# Altium schematic sheet AddressingMuxes_1.SchDoc
size A4
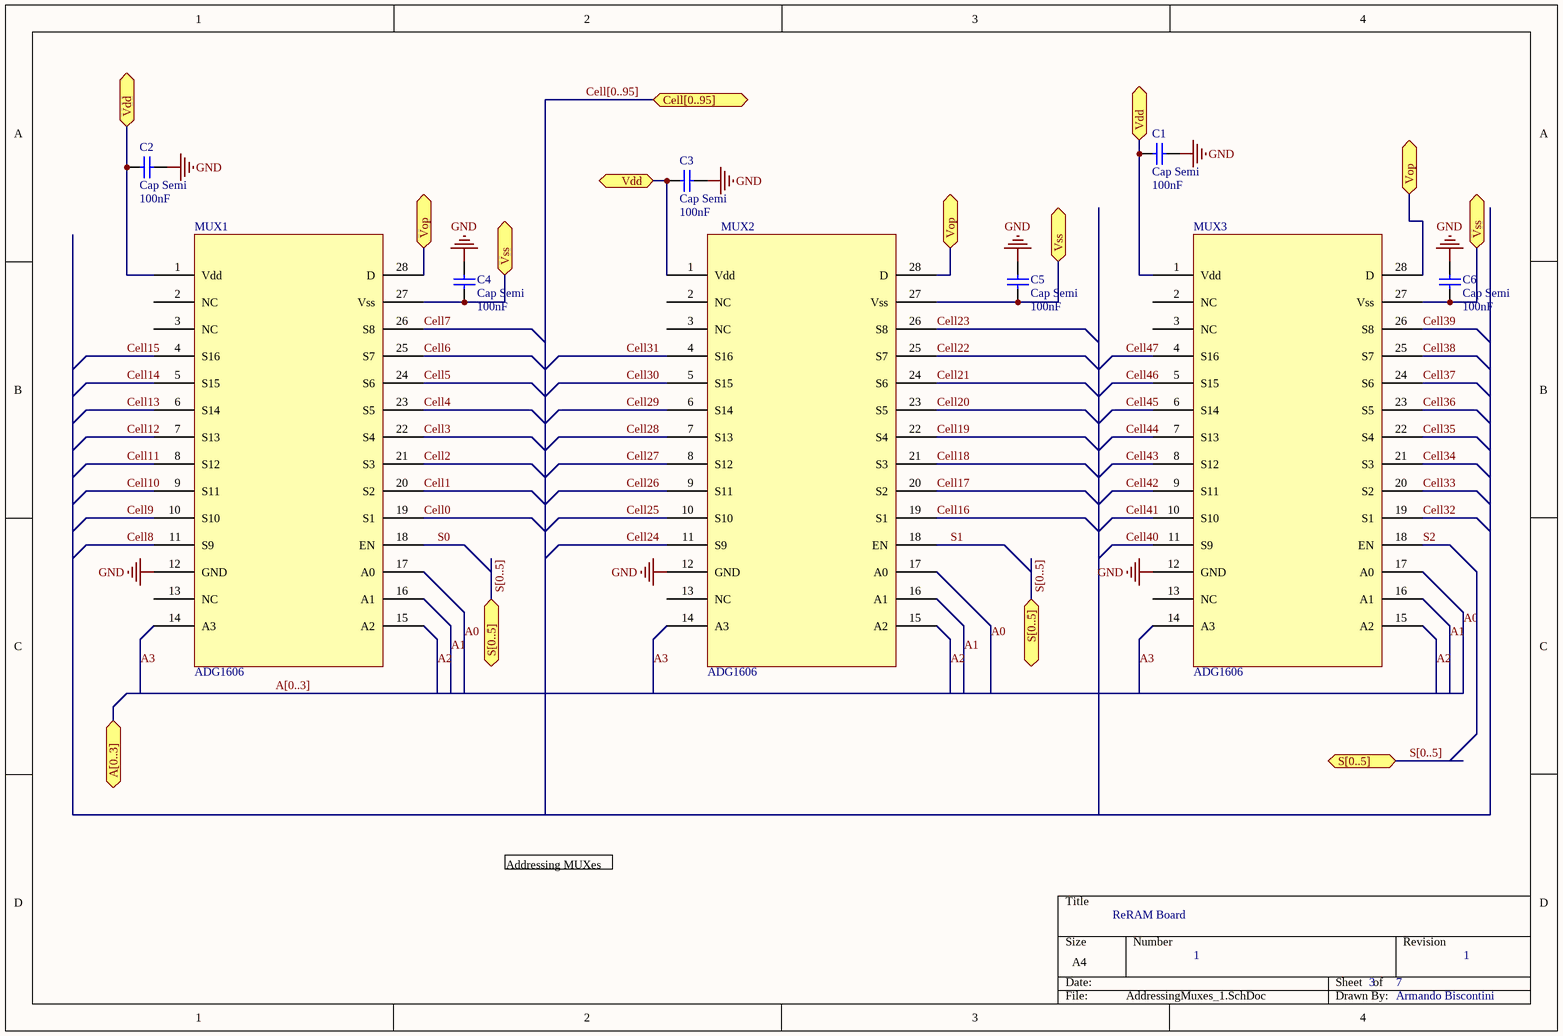
[diagram p0: AddressingMuxes_1.SchDoc]

## Parts
C1  Cap Semi  value 100nF  [C1206]
C2  Cap Semi  value 100nF  [C1206]
C3  Cap Semi  value 100nF  [C1206]
C4  Cap Semi  value 100nF  [C1206]
C5  Cap Semi  value 100nF  [C1206]
C6  Cap Semi  value 100nF  [C1206]
MUX1  ADG1606  [TSOP65P640X120-28N]
MUX2  ADG1606  [TSOP65P640X120-28N]
MUX3  ADG1606  [TSOP65P640X120-28N]

## Ports
A[0..3], Cell[0..95], S[0..5], Vdd, Vop, Vss

## Nets
GND: C1.1 C2.2 C3.2 C4.2 C5.2 C6.1 MUX1.12(GND) MUX2.12(GND) MUX3.12(GND)
A0: MUX1.17(A0) MUX2.17(A0) MUX3.17(A0)
A1: MUX1.16(A1) MUX2.16(A1) MUX3.16(A1)
A2: MUX1.15(A2) MUX2.15(A2) MUX3.15(A2)
A3: MUX1.14(A3) MUX2.14(A3) MUX3.14(A3)
Cell0: MUX1.19(S1)
Cell1: MUX1.20(S2)
Cell2: MUX1.21(S3)
Cell3: MUX1.22(S4)
Cell4: MUX1.23(S5)
Cell5: MUX1.24(S6)
Cell6: MUX1.25(S7)
Cell7: MUX1.26(S8)
Cell8: MUX1.11(S9)
Cell9: MUX1.10(S10)
Cell10: MUX1.9(S11)
Cell11: MUX1.8(S12)
Cell12: MUX1.7(S13)
Cell13: MUX1.6(S14)
Cell14: MUX1.5(S15)
Cell15: MUX1.4(S16)
Cell16: MUX2.19(S1)
Cell17: MUX2.20(S2)
Cell18: MUX2.21(S3)
Cell19: MUX2.22(S4)
Cell20: MUX2.23(S5)
Cell21: MUX2.24(S6)
Cell22: MUX2.25(S7)
Cell23: MUX2.26(S8)
Cell24: MUX2.11(S9)
Cell25: MUX2.10(S10)
Cell26: MUX2.9(S11)
Cell27: MUX2.8(S12)
Cell28: MUX2.7(S13)
Cell29: MUX2.6(S14)
Cell30: MUX2.5(S15)
Cell31: MUX2.4(S16)
Cell32: MUX3.19(S1)
Cell33: MUX3.20(S2)
Cell34: MUX3.21(S3)
Cell35: MUX3.22(S4)
Cell36: MUX3.23(S5)
Cell37: MUX3.24(S6)
Cell38: MUX3.25(S7)
Cell39: MUX3.26(S8)
Cell40: MUX3.11(S9)
Cell41: MUX3.10(S10)
Cell42: MUX3.9(S11)
Cell43: MUX3.8(S12)
Cell44: MUX3.7(S13)
Cell45: MUX3.6(S14)
Cell46: MUX3.5(S15)
Cell47: MUX3.4(S16)
S0: MUX1.18(EN)
S1: MUX2.18(EN)
S2: MUX3.18(EN)
Vdd: C1.2 C2.1 C3.1 MUX1.1(Vdd) MUX2.1(Vdd) MUX3.1(Vdd) ; port Vdd
Vop: MUX1.28(D) MUX2.28(D) MUX3.28(D) ; port Vop
Vss: C4.1 C5.1 C6.2 MUX1.27(Vss) MUX2.27(Vss) MUX3.27(Vss) ; port Vss

Not connected (* = marked no-connect by the designer): MUX1 2(NC) 3(NC) 13(NC); MUX2 2(NC) 3(NC) 13(NC); MUX3 2(NC) 3(NC) 13(NC)

## Buses and harness runs
bus A[0..3] = port A[0..3]
bus Cell[0..95] = port Cell[0..95]
bus S[0..5] = port S[0..5]

## Notes on the sheet
- Addressing MUXes
- ReRAM Board
- 1
- 3
- 7
- Armando Biscontini

## Library data of the parts
C1-C6 = Cap Semi: Capacitor (Semiconductor SIM Model); Published: 8-Jun-2000; LatestRevisionDate: 29-May-2009; LatestRevisionNote: IPC-7351 Footprint Added.; PackageReference: C1206; Publisher: Altium Limited; PackageDescription: Chip Capacitor
MUX1-MUX3 = ADG1606: Analog Devices ADG1606